# Altium schematic sheet P1.schdoc
size 420 x 297 mm; Symbol: Sheet-Symbol_A4; Company: 嘉立创EDA; Version: V1.0; Page Size: A4; @Project Name: AI开发板; @Page Count: 1; @Update Date: 2025-10-23; @Create Date: 2025-10-11; @Schematic Name: Schematic2; @Page No: 0; @Page Name: P1; Device: Sheet-Symbol_A4; @Board Name: 头戴式; @Create Time: 11:14:55; @Update Time: 22:55:59; Border: 1; Width: 1655; Height: 1170; Region Start: 1; X Region Count: 6; Y Region Count: 4; Blade Width: 10; Title Block Position: 3
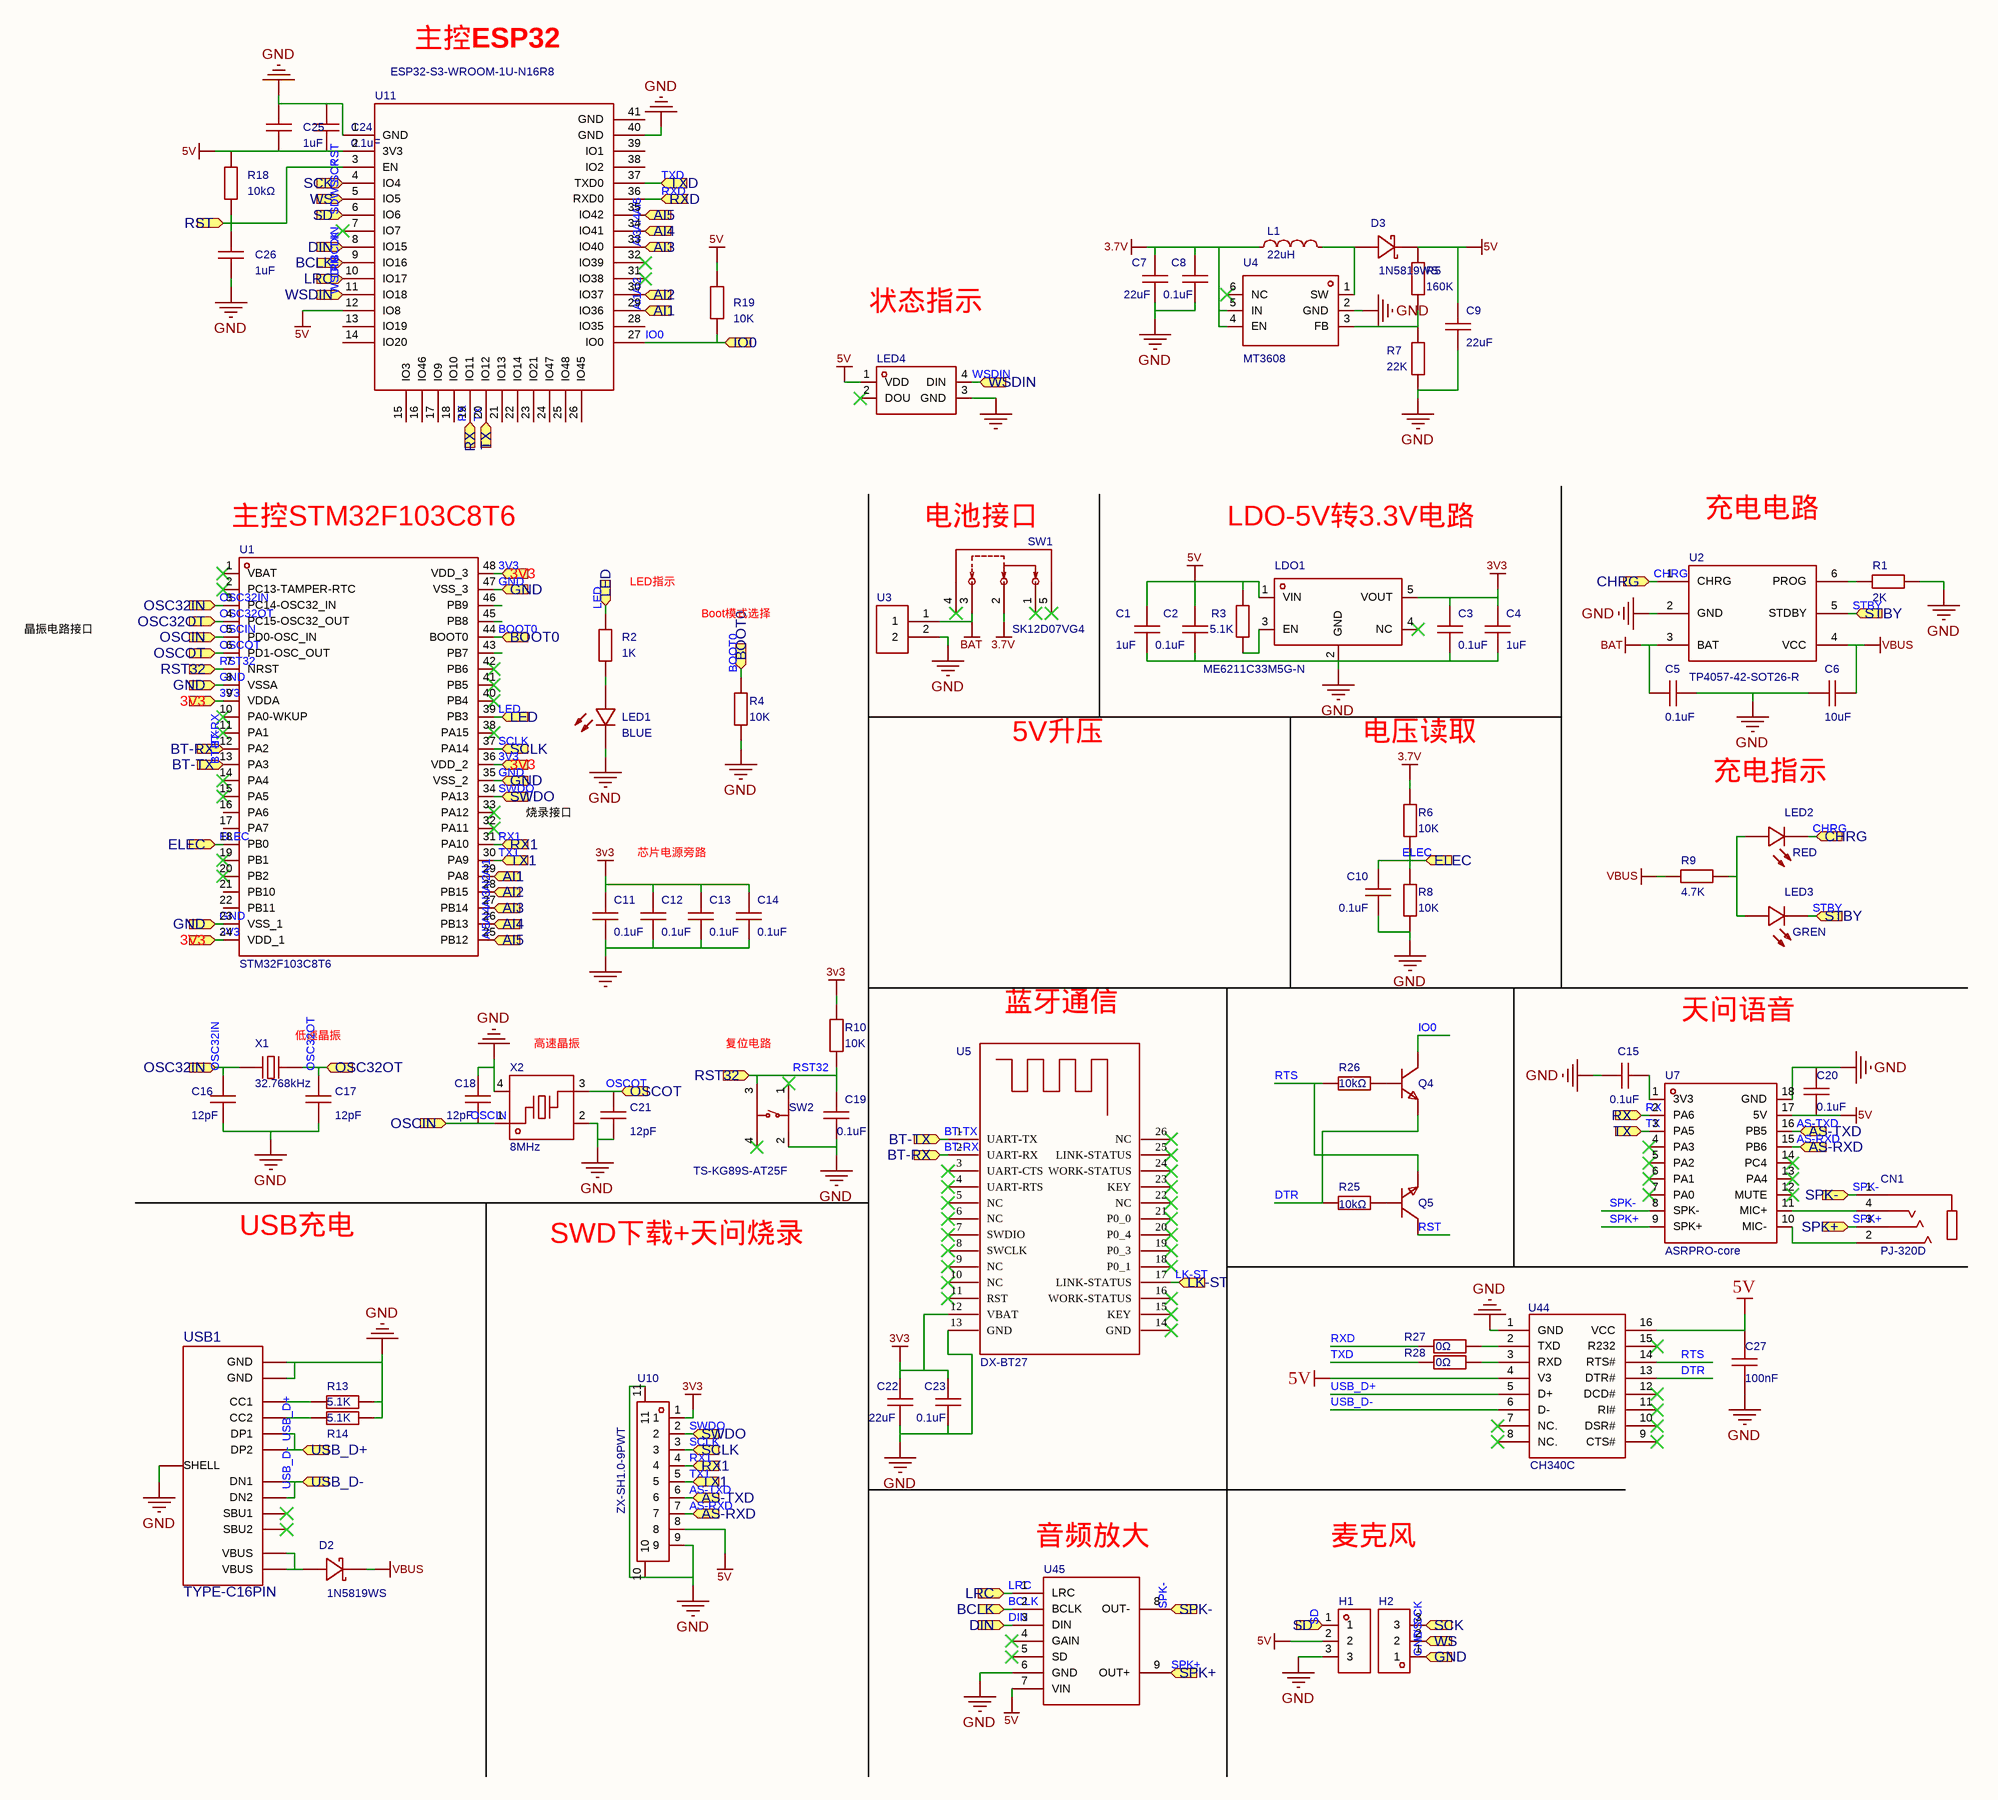
[diagram p0: P1.schdoc]

## Parts
C1  1uF  [C0603]
C2  0.1uF  [C0603]
C3  0.1uF  [C0603]
C4  1uF  [C0603]
C5  0.1uF  [C0603]
C6  10uF  [C0603]
C7  22uF  [C0603]
C8  0.1uF  [C0603]
C9  22uF  [C0603]
C10  0.1uF  [C0603]
C11  0.1uF  [C0603]
C12  0.1uF  [C0603]
C13  0.1uF  [C0603]
C14  0.1uF  [C0603]
C15  0.1uF  [C0603]
C16  12pF  [C0603]
C17  12pF  [C0603]
C18  12pF  [C0603]
C19  0.1uF  [C0603]
C20  0.1uF  [C0603]
C21  12pF  [C0603]
C22  22uF  [C0603]
C23  0.1uF  [C0603]
C24  0.1uF  [C0603]
C25  1uF  [C0603]
C26  value 1uF  [C0603]  (hidden comment: CL10A105KB8NNNC)
C27  value 100nF  [C0603]  (hidden comment: CC0603KRX7R9BB104)
CN1  PJ-320D  [AUDIO-SMD_PJ-320D]
D2  1N5819WS  [SOD-323_L1.6-W1.3-LS2.7-RD]
D3  1N5819WS  [SOD-323_L1.6-W1.3-LS2.7-RD]
H1  PZ254V-11-03P  [HDR-TH_3P-P2.54-V-M]  (value not drawn)
H2  PZ254V-11-03P  [HDR-TH_3P-P2.54-V-M]  (value not drawn)
L1  22uH  [IND-SMD_L7.4-W6.6]
LDO1  ME6211C33M5G-N  [SOT-23-5_L3.0-W1.7-P0.95-LS2.8-BL]
LED1  BLUE  [LED0603-RD_RED]
LED2  RED  [LED0603-RD_RED]
LED3  GREN  [LED0603-RD_RED]
LED4  XL-5050RGBC-WS2812B  [LED-SMD_4P-L5.0-W5.0-BL_XL-5050RGBC]  (value not drawn)
Q4  SS8050_C2150  [SOT-23-3_L2.9-W1.3-P1.90-LS2.4-BR]  (value not drawn)
Q5  SS8050_C2150  [SOT-23-3_L2.9-W1.3-P1.90-LS2.4-BR]  (value not drawn)
R1  2K  [R0603]
R2  1K  [R0603]
R3  5.1K  [R0603]
R4  10K  [R0603]
R5  160K  [R0603]
R6  10K  [R0603]
R7  22K  [R0603]
R8  10K  [R0603]
R9  4.7K  [R0603]
R10  10K  [R0603]
R13  5.1K  [R0603]
R14  5.1K  [R0603]
R18  value 10kΩ  [R0603]  (hidden comment: 0603WAF1002T5E)
R19  10K  [R0603]
R25  10kΩ  [R0603]
R26  10kΩ  [R0603]
R27  value 0Ω  [R0603]  (hidden comment: 0603WAF0000T5E)
R28  value 0Ω  [R0603]  (hidden comment: 0603WAF0000T5E)
SW1  SK12D07VG4  [SW-TH_SK12D07VG4]
SW2  TS-KG89S-AT25F  [SW-SMD_4P-L4.2-W3.3-P2.15-LS5.1]
U1  STM32F103C8T6  [LQFP-48_L7.0-W7.0-P0.50-LS9.0-BL]
U2  TP4057-42-SOT26-R  [SOT-23-6_L2.9-W1.6-P0.95-LS2.8-BL]
U3  (no value)  [1*2-2.54单排针]
U4  MT3608  [SOT-23-6_L2.9-W1.6-P0.95-LS2.8-BL]
U5  DX-BT27  [DX-BT24]
U7  ASRPRO-core  [COMM-SMD_ASRPRO-CORE-V1.1]
U10  ZX-SH1.0-9PWT  [CONN-SMD_9P-P1.00_ZX-SH1.0-9PWT]
U11  ESP32-S3-WROOM-1U-N16R8  [WIRELM-SMD_ESP32-S3-WROOM-1U]
U44  CH340C  [SOP-16_L10.0-W3.9-P1.27-LS6.0-BL]
U45  (no value)  [MAX98357moudle]
USB1  TYPE-C16PIN  [usb-c-smd_type-c16pin-shouhan]
X1  32.768kHz  [OSC-SMD_L3.2-W1.5]
X2  8MHz  [CRYSTAL-SMD_4P-L3.2-W2.5-BL-1]

## Ports
3V3 (in), AI1 (in), AI2 (in), AI3 (in), AI4 (in), AI5 (in), AS-RXD (in), AS-TXD (in), BCLK (in), BOOT0 (in), BT-RX (in), BT-TX (in), CHRG (in), DIN (in), ELEC (in), GND (in), IO0 (in), LED (in), LK-ST (in), LRC (in), OSC32IN (in), OSC32OT (in), OSCIN (in), OSCOT (in), RST32 (in), RST (in), RX1 (in), RX (in), RXD (in), SCK (in), SCLK (in), SD (in), SPK+ (in), SPK- (in), STBY (in), SWDO (in), TX1 (in), TX (in), TXD (in), USB_D+ (in), USB_D- (in), WS (in), WSDIN (in)

## Nets
3.7V: C7.2 C8.2 L1.1 R6.2 SW1.2 U4.4(EN) U4.5(IN)
3V3: C3.2 C4.2 C11.2 C12.2 C13.2 C14.2 C22.2 C23.2 LDO1.5(VOUT) R10.2 U1.9(VDDA) U1.24(VDD_1) U1.36(VDD_2) U1.48(VDD_3) U5.12(VBAT) U10.1 ; port 3V3
5V: C1.2 C2.2 C9.2 C20.1 C24.1 C25.1 C27.1 D3.1(K) H1.2 LDO1.1(VIN) LED4.1(VDD) R3.1 R5.1 R18.2 R19.2 U7.17(5V) U10.8 U11.2(3V3) U11.12(IO8) U44.4(V3) U44.16(VCC) U45.7(VIN)
BAT: C5.2 SW1.3 U2.3(BAT) U3.1
GND: C1.1 C2.1 C3.1 C4.1 C5.1 C6.2 C7.1 C8.1 C9.1 C10.1 C11.1 C12.1 C13.1 C14.1 C15.2 C16.1 C17.1 C18.2 C19.1 C20.2 C21.1 C22.1 C23.1 C24.2 C25.2 C26.1 C27.2 H1.3 H2.1 LDO1.2(GND) LED1.1(K) LED4.3(GND) R1.1 R4.1 R7.2 R8.1 R13.1 R14.1 SW2.2 U1.8(VSSA) U1.23(VSS_1) U1.35(VSS_2) U1.47(VSS_3) U2.2(GND) U3.2 U4.2(GND) U5.13(GND) U7.18(GND) U10.9 U10.10 U10.11 U11.1(GND) U11.40(GND) U44.1(GND) U45.6(GND) USB1.1(SHELL) USB1.2(SHELL) USB1.3(SHELL) USB1.4(SHELL) USB1.A1B12(GND) USB1.B1A12(GND) X2.2(GND) X2.4(GND) ; port GND
VBUS: C6.1 D2.1(K) R9.2 U2.4(VCC)
AI1: U1.29(PA8) U11.29(IO36) ; port AI1
AI2: U1.28(PB15) U11.30(IO37) ; port AI2
AI3: U1.27(PB14) U11.33(IO40) ; port AI3
AI4: U1.26(PB13) U11.34(IO41) ; port AI4
AI5: U1.25(PB12) U11.35(IO42) ; port AI5
AS-RXD: U7.15(PB6) U10.7 ; port AS-RXD
AS-TXD: U7.16(PB5) U10.6 ; port AS-TXD
BCLK: U11.9(IO16) U45.2(BCLK) ; port BCLK
BOOT0: R4.2 U1.44(BOOT0) ; port BOOT0
BT-RX: U1.12(PA2) U5.2(UART-RX) ; port BT-RX
BT-TX: U1.13(PA3) U5.1(UART-TX) ; port BT-TX
CHRG: LED2.1(K) U2.1(CHRG) ; port CHRG
DIN: U11.8(IO15) U45.3(DIN) ; port DIN
DTR: Q4.2(E) R25.2 U44.13(DTR#)
ELEC: C10.2 R6.1 R8.2 U1.18(PB0) ; port ELEC
IO0: Q4.3(C) R19.1 U11.27(IO0) ; port IO0
LED: R2.2 U1.39(PB3) ; port LED
LK-ST: U5.17(LINK-STATUS) ; port LK-ST
LRC: U11.10(IO17) U45.1(LRC) ; port LRC
OSC32IN: C16.2 U1.3(PC14-OSC32_IN) X1.1 ; port OSC32IN
OSC32OT: C17.2 U1.4(PC15-OSC32_OUT) X1.2 ; port OSC32OT
OSCIN: C18.1 U1.5(PD0-OSC_IN) X2.1 ; port OSCIN
OSCOT: C21.2 U1.6(PD1-OSC_OUT) X2.3 ; port OSCOT
RST: C26.2 Q5.3(C) R18.1 U11.3(EN) ; port RST
RST32: C19.2 R10.1 SW2.3 U1.7(NRST) ; port RST32
RTS: Q5.2(E) R26.2 U44.14(RTS#)
RX: U7.2(PA6) U11.19(IO11) ; port RX
RX1: U1.31(PA10) U10.4 ; port RX1
RXD: R27.2 U11.36(RXD0) ; port RXD
SCK: H2.3 U11.4(IO4) ; port SCK
SCLK: U1.37(PA14) U10.3 ; port SCLK
SD: H1.1 U11.6(IO6) ; port SD
SPK+: CN1.3 U7.9(SPK+) U45.9(OUT+) ; port SPK+
SPK-: CN1.1 U7.8(SPK-) U45.8(OUT-) ; port SPK-
STBY: LED3.1(K) U2.5(STDBY) ; port STBY
SWDO: U1.34(PA13) U10.2 ; port SWDO
TX: U7.3(PA5) U11.20(IO12) ; port TX
TX1: U1.30(PA9) U10.5 ; port TX1
TXD: R28.2 U11.37(TXD0) ; port TXD
USB_D+: U44.5(D+) USB1.A6(DP1) USB1.B6(DP2) ; port USB_D+
USB_D-: U44.6(D-) USB1.A7(DN1) USB1.B7(DN2) ; port USB_D-
WS: H2.2 U11.5(IO5) ; port WS
WSDIN: LED4.4(DIN) U11.11(IO18) ; port WSDIN
NetC15_1: C15.1 U7.1(3V3)
NetCN1_2: CN1.2 U7.10(MIC-)
NetCN1_4: CN1.4 U7.11(MIC+)
NetD2_2: D2.2(A) USB1.A4B9(VBUS) USB1.B4A9(VBUS)
NetD3_2: D3.2(A) L1.2 U4.1(SW)
NetLDO1_3: LDO1.3(EN) R3.2
NetLED1_2: LED1.2(A) R2.1
NetLED2_2: LED2.2(A) LED3.2(A) R9.1
NetQ4_1: Q4.1(B) R26.1
NetQ5_1: Q5.1(B) R25.1
NetR1_2: R1.2 U2.6(PROG)
NetR5_2: R5.2 R7.1 U4.3(FB)
NetR13_2: R13.2 USB1.A5(CC1)
NetR14_2: R14.2 USB1.B5(CC2)
NetR27_1: R27.1 U44.2(TXD)
NetR28_1: R28.1 U44.3(RXD)

Not connected (* = marked no-connect by the designer): LDO1 4(NC)*; LED4 2(DOU)*; SW1 1* 4* 5*; SW2 1* 4*; U1 1(VBAT)* 2(PC13-TAMPER-RTC)* 10(PA0-WKUP)* 11(PA1)* 14(PA4)* 15(PA5)* 16(PA6) 17(PA7) 19(PB1)* 20(PB2)* 21(PB10) 22(PB11) 32(PA11)* 33(PA12)* 38(PA15)* 40(PB4)* 41(PB5)* 42(PB6)* 43(PB7) 45(PB8) 46(PB9); U4 6(NC)*; U5 3(UART-CTS)* 4(UART-RTS)* 5(NC)* 6(NC)* 7(SWDIO)* 8(SWCLK)* 9(NC)* 10(NC)* 11(RST)* 14(GND)* 15(KEY)* 16(WORK-STATUS)* 18(P0_1)* 19(P0_3)* 20(P0_4)* 21(P0_0)* 22(NC)* 23(KEY)* 24(WORK-STATUS)* 25(LINK-STATUS)* 26(NC)*; U7 4(PA3)* 5(PA2)* 6(PA1)* 7(PA0)* 12(MUTE)* 13(PA4)* 14(PC4)*; U11 7(IO7)* 13(IO19) 14(IO20) 15(IO3) 16(IO46) 17(IO9) 18(IO10) 21(IO13) 22(IO14) 23(IO21) 24(IO47) 25(IO48) 26(IO45) 28(IO35) 31(IO38)* 32(IO39)* 38(IO2) 39(IO1) 41(GND); U44 7(NC.)* 8(NC.)* 9(CTS#)* 10(DSR#)* 11(RI#)* 12(DCD#)* 15(R232)*; U45 4(GAIN)* 5(SD)*; USB1 A8(SBU1)* B8(SBU2)*

## Notes on the sheet
- 主控ESP32
- 状态指示
- (near U1) 主控STM32F103C8T6
- (near SW1) 电池接口
- LDO-5V转3.3V电路
- (near U2) 充电电路
- 晶振电路接口
- (near R2) LED指示
- Boot模式选择
- 5V升压
- 电压读取
- 充电指示
- (near U1) 烧录接口
- 芯片电源旁路
- 蓝牙通信
- 天问语音
- (near X1) 低速晶振
- (near X2) 高速晶振
- (near SW2) 复位电路
- USB充电
- SWD下载+天问烧录
- (near U45) 音频放大
- 麦克风
- 更新日期
- 2025-10-23
- 原理图
- 图页
- Schematic2
- P1
- 创建日期
- 物料编码
- 2025-10-11
- 审阅
- 绘制
- AI开发板
- 版本
- V1.0
- 尺寸
- A4
- 页
- 0
- 嘉立创EDA
- 共
- 1

## Library data of the parts
C1-C26 = CL10A105KB8NNNC: 容值:1uF;精度:±10%;额定电压:50V;材质(温度系数):X5R;; Manufacturer: SAMSUNG(三星); AddInBom: yes; ModelId: ac125912035d415993ca9572d50418b1; ModelName: C0603_L1.6-W0.8-H0.8; ModelTransform: 62.992,31.496,0,0,0,0,0,0,0; Tolerance: ±10%; Voltage Rated: 50V; Temperature Coefficient: X5R; Device: CL10A105KB8NNNC; Symbol: CL10A105KB8NNNC; LCSC Part Name: 1uF±10%50V; ManufacturerPart: CL10A105KB8NNNC; Supplier Footprint: 0603; JLCPCB Part Class: BasicPart; Datasheet: https://atta.szlcsc.com/upload/public/pdf/source/20160103/1457707679084.pdf; Supplier: LCSC; ConvertToPcb: yes; FootprintName: C0603
  C1 C4: Value: 1uF
  C2 C3 C5 C8 C10-C15 C19 C20 C23 C24: Value: 0.1uF
  C6: Value: 10uF
  C7 C9 C22: Value: 22uF
  C16-C18 C21: Value: 12pF
  C25: SupplierPart: C15849; Value: 1uF
  C26: SupplierPart: C15849
C27 = CC0603KRX7R9BB104: 容值:100nF;精度:±10%;额定电压:50V;材质(温度系数):X7R;; Manufacturer: YAGEO(国巨); Symbol: C1210X7R475K630NT; AddInBom: yes; ModelId: ac125912035d415993ca9572d50418b1; ModelName: C0603_L1.6-W0.8-H0.8; ModelTransform: 62.992,31.496,0,0,0,0,0,0,0; Tolerance: ±10%; Voltage Rated: 50V; Temperature Coefficient: X7R; Device: CC0603KRX7R9BB104; LCSC Part Name: 100nF ±10% 50V; SupplierPart: C14663; ManufacturerPart: CC0603KRX7R9BB104; Supplier Footprint: 0603; JLCPCB Part Class: Basic Part; Datasheet: https://atta.szlcsc.com/upload/public/pdf/source/20170116/1484561234239.pdf; Supplier: LCSC; ConvertToPcb: yes; FootprintName: C0603
CN1 = PJ-320D_C431535: 连接器类型:3.5mm耳机座;额定电流:300mA;额定电压:50V;工作温度范围:-16℃~+65℃;; Manufacturer: SHOU HAN(首韩); AddInBom: yes; ModelId: bd09d36f1dc146ba8e7977b9497f1865; ModelName: AUDIO-SMD_L12.1-W6.1-H5.0-4P; ModelTransform: 314.96,555.117,0,0,0,0,0.001,87.24,-27.559; Current Rating (Max): 300mA; Voltage Rating (Max): 50V; Symbol: PJ-320D; Device: PJ-320D_C431535; LCSC Part Name: 3.5mm耳机座; SupplierPart: C431535; ManufacturerPart: PJ-320D; Supplier Footprint: SMD; Datasheet: https://atta.szlcsc.com/upload/public/pdf/source/20190925/C431535_8B274506621F6117FB020BF07A197848.pdf; Supplier: LCSC; ConvertToPcb: yes; FootprintName: AUDIO-SMD_PJ-320D; Connector Type: 3.5mm耳机座; Operating Temperature Range: -16℃~+65℃
D2 D3 = 1N5819WS_C727116: Manufacturer: TWGMC(台湾迪嘉); AddInBom: yes; ModelId: 39bca86493a8419684ee2090e9340edf; ModelTransform: 104.3305,51.181,0,0,0,0,0,0,0; Device: 1N5819WS_C727116; Symbol: 1N5819WS_C727116; LCSC Part Name: 1N5819WS; SupplierPart: C727116; ManufacturerPart: 1N5819WS; Supplier Footprint: SOD-323; JLCPCB Part Class: Extended Part; Datasheet: https://atta.szlcsc.com/upload/public/pdf/source/20200828/C727114_C14023D00363B04EEE1ED2B617BD8BD7.pdf; Supplier: LCSC; ConvertToPcb: yes; FootprintName: SOD-323_L1.6-W1.3-LS2.7-RD; ModelName: SOD-323_L1.6-W1.3-LS2.7-RD
H1 H2 = PZ254V-11-03P: 插针结构:1x3P;间距:2.54mm;行距:-;圆针/方针:方针;安装方式:直插;排数:单排;总PIN位数:3P;额定电流:3A;额定电压:250V;配合针长度:6mm;塑高:2.5mm;端接针长度:3mm;工作温度:-40℃~+105℃;颜色:黑色;; Manufacturer: XFCN(兴飞); Symbol: PZ254V-11-03P_C2937625; AddInBom: yes; ModelId: bb473b6d38ff42a99216a4fcdbdcc4cb; ModelName: HDR-TH_3P-P2.54-M-LI-1X3P; ModelTransform: 299.9994,100,0,0,0,0,0,0,-118.11; Pin Structure: 1x3P; Pitch: 2.54mm; Circluar Pins/Square Pins: 方针; Current Rating: 3A; Voltage Rating (Max): 250V; Device: PZ254V-11-03P; LCSC Part Name: 1x3P 间距:2.54mm 方针 直插; SupplierPart: C2937625; ManufacturerPart: PZ254V-11-03P; Supplier Footprint: 插件,P=2.54mm; JLCPCB Part Class: 扩展库; Datasheet: https://atta.szlcsc.com/upload/public/pdf/source/20200309/C492402_8335C3D49C4E4C618838D59BB1D024C1.pdf; Supplier: LCSC; ConvertToPcb: yes; FootprintName: HDR-TH_3P-P2.54-V-M; Row Spacing: -; Mounting Type: 直插; Number of Rows: 单排; Number of Pins: 3P; Length of Mating Pin: 6mm; Insulation Height: 2.5mm; Length of End Connection Pin: 3mm; Operating Temperature: -40℃~+105℃; Color: 黑色
L1 = MS0630-220M: 电感值:22uH;精度:±20%;额定电流:1.5A;; Manufacturer: COILMX(迈翔科技); AddInBom: yes; ModelId: 6ebe9088926641d898f5999c0d913d3a; ModelName: IND-SMD_L7.4-W6.6-H1.8; ModelTransform: 291.338,259.842,0,0,0,0,0,0,0; Tolerance: ±20%; Rated Current: 1.5A; DC Resistance (DCR): 165mΩ; Device: MS0630-220M; Symbol: MS0630-220M; LCSC Part Name: 22uH ±20%; SupplierPart: C380183; ManufacturerPart: MS0630-220M; Supplier Footprint: SMD; JLCPCB Part Class: 扩展库; Datasheet: https://atta.szlcsc.com/upload/public/pdf/source/20190429/C380183_D15BB80F49C96307481ABD5C565771EF.pdf; Supplier: LCSC; ConvertToPcb: yes; FootprintName: IND-SMD_L7.4-W6.6; Value: 22uH
LDO1 = ME6211C33M5G-N: 输出类型:固定;输出极性:正;最大输入电压:6V;输出电压:3.3V;输出电流:500mA;电源纹波抑制比(PSRR):70dB;; Manufacturer: MICRONE(南京微盟); AddInBom: yes; Output Type: 固定; Output Polarity: 正; Number of Outputs: 1; Maximum Input Voltage: 6V; Output Voltage: 3.3V; Dropout Voltage: 260mV@(200mA); Output Current: 500mA; Power Supply Rejection Ratio (PSRR): 70dB; ModelId: 0a2a1b8f50944f73965918ad6e5fe167; ModelName: SOT-23-5_L2.9-W1.6-H1.1-LS2.8-P0.95; ModelTransform: 118.60433,114.173,0,90,0,0,0.0005,0.0005,0; Device: ME6211C33M5G-N; LCSC Part Name: ME6211C33M5G-N; SupplierPart: C82942; ManufacturerPart: ME6211C33M5G-N; Supplier Footprint: SOT-23-5; Datasheet: https://atta.szlcsc.com/upload/public/pdf/source/20170918/C82942_1505727073070976520.pdf; Supplier: LCSC; ConvertToPcb: yes; SymbolName: ME6211C33M5G-N; FootprintName: SOT-23-5_L3.0-W1.7-P0.95-LS2.8-BL
LED1-LED3 = NCD0603R1_C84263: 发光颜色:红灯;; Manufacturer: 国星光电; Symbol: FC-DA1608HRK-620D; AddInBom: yes; ModelId: 74041d3a270d435c8600a9ab9b7641c0; ModelTransform: 63.7794,31.496,0,0,0,0,0,0,0; Emitted Color: 红灯; Device: NCD0603R1_C84263; LCSC Part Name: 红灯; SupplierPart: C84263; Supplier Footprint: 0603; Datasheet: https://atta.szlcsc.com/upload/public/pdf/source/20200820/C84263_DABC6A75E58F576973B407FDBA283D60.pdf; Supplier: LCSC; ConvertToPcb: yes; FootprintName: LED0603-RD_RED; ModelName: LED0603-RD_RED
  LED1: Manufacturer Part: BLUE
  LED2: Manufacturer Part: RED
  LED3: Manufacturer Part: GREN
LED4 = XL-5050RGBC-WS2812B: 5050七彩幻彩透明贴片LED灯珠 5050 幻彩透明四脚 ws2812B 内置驱动IC; Manufacturer: XINGLIGHT(成兴光); AddInBom: yes; ModelId: 5168ba52986f49888734e6544170656a; ModelTransform: 212.598,196.85,0,270,0,0,0,0,0; Symbol: XL-5050RGBC-WS2812B; Device: XL-5050RGBC-WS2812B; LCSC Part Name: XL-5050RGBC-WS2812B; SupplierPart: C2843785; ManufacturerPart: XL-5050RGBC-WS2812B; Supplier Footprint: SMD5050; JLCPCB Part Class: 扩展库; Datasheet: https://atta.szlcsc.com/upload/public/pdf/source/20240412/E1004CAA80592E31D08BFE019083806F.pdf; Supplier: LCSC; ConvertToPcb: yes; FootprintName: LED-SMD_4P-L5.0-W5.0-BL_XL-5050RGBC; ModelName: LED-SMD_4P-L5.0-W5.0-BL_XL-5050RGBC
Q4 Q5 = SS8050_C2150: 晶体管类型:NPN;集电极电流(Ic):1.5A;集射极击穿电压(Vceo):25V;功率(Pd):300mW;直流电流增益(hFE@Ic,Vce):200@100mA,1V;; Manufacturer: CJ(江苏长电/长晶); ManufacturerPart: SS8050; AddInBom: yes; ModelId: c62791f0466c4ae2a892c056b845b0ca; ModelName: SOT-23-3P_L2.9-W1.3-H1.0-LS2.4-P0.95; ModelTransform: 98.425,114.173,0,180,0,0,0.0005,-0.0005,0; Transistor Type: NPN; Collector Current (Ic): 1.5A; Collector-Emitter Breakdown Voltage (Vceo): 25V; Power Dissipation (Pd): 300mW; Transition Frequency (fT): 100MHz; Collector Cut-Off Current (Icbo): 100nA; Collector-Emitter Saturation Voltage (VCE(sat)@Ic,Ib): 500mV@800mA,80mA; Symbol: SS8050_C2150; Device: SS8050_C2150; LCSC Part Name: SS8050(RANGE:200-350) hfe=200~350; SupplierPart: C2150; Supplier Footprint: SOT-23; JLCPCB Part Class: 基础库; Datasheet: https://atta.szlcsc.com/upload/public/pdf/source/20230322/AEE86F4B043774EFF80CAEA14A37D9E9.pdf; Supplier: LCSC; ConvertToPcb: yes; FootprintName: SOT-23-3_L2.9-W1.3-P1.90-LS2.4-BR; DC Current Gain (hFE@Ic,Vce): 200@100mA,1V; Operating Temperature: -
R1-R10 R13 R14 R18 R19 = 0603WAF1002T5E: 电阻类型:厚膜电阻;阻值:10kΩ;精度:±1%;功率:100mW;; Manufacturer: UNI-ROYAL(厚声); AddInBom: yes; ModelId: fc143cca1e79419f9cd78b61e9279f08; ModelTransform: 31.8897,63.7794,0,90,0,0,0,0,0; Tolerance: ±1%; Power(Watts): 100mW; Temperature Coefficient: ±100ppm/℃; Overload Voltage (Max): 75V; Device: 0603WAF1002T5E; Symbol: 0603WAF1002T5E; LCSC Part Name: 厚膜电阻10kΩ±1%100mW; ManufacturerPart: 0603WAF1002T5E; Supplier Footprint: 0603; JLCPCB Part Class: BasicPart; Datasheet: https://atta.szlcsc.com/upload/public/pdf/source/20200306/C422600_1E6D84923E4A46A82E41ADD87F860B5C.pdf; Supplier: LCSC; ConvertToPcb: yes; FootprintName: R0603; ModelName: R0603; Type: 厚膜电阻; Operating Temperature Range: -55℃~+155℃
  R1: Value: 2K
  R2: Value: 1K
  R3 R13 R14: Value: 5.1K
  R4 R6 R8 R10 R19: Value: 10K
  R5: Value: 160K
  R7: Value: 22K
  R9: Value: 4.7K
  R18: SupplierPart: C25804
R25 R26 = 0603WAF1002T5E: 电阻类型:厚膜电阻;阻值:10kΩ;精度:±1%;功率:100mW;最大工作电压:75V;温度系数:±100ppm/℃;; Manufacturer: UNI-ROYAL(厚声); Symbol: 电阻_1; AddInBom: yes; ModelId: fc143cca1e79419f9cd78b61e9279f08; ModelTransform: 31.8897,63.7794,0,90,0,0,0,0,0; Tolerance: ±1%; Power(Watts): 100mW; Overload Voltage (Max): 75V; Value: 10kΩ; Device: 0603WAF1002T5E; LCSC Part Name: 厚膜电阻10kΩ±1%100mW; SupplierPart: C25804; ManufacturerPart: 0603WAF1002T5E; Supplier Footprint: 0603; JLCPCB Part Class: BasicPart; Datasheet: https://atta.szlcsc.com/upload/public/pdf/source/20200306/C422600_1E6D84923E4A46A82E41ADD87F860B5C.pdf; Supplier: LCSC; ConvertToPcb: yes; FootprintName: R0603; ModelName: R0603; Type: 厚膜电阻; Temperature Coefficient: ±100ppm/℃; Operating Temperature Range: -55℃~+155℃
R27 R28 = 0603WAF0000T5E: 电阻类型:厚膜电阻;阻值:0Ω;精度:±1%;功率:100mW;; Manufacturer: UNI-ROYAL(厚声); AddInBom: yes; ModelId: fc143cca1e79419f9cd78b61e9279f08; ModelTransform: 31.8897,63.7794,0,90,0,0,0,0,0; Tolerance: ±1%; Power(Watts): 100mW; Overload Voltage (Max): 75V; Device: 0603WAF0000T5E; Symbol: 0603WAF0000T5E; LCSC Part Name: 0Ω ±1% 100mW; SupplierPart: C21189; ManufacturerPart: 0603WAF0000T5E; Supplier Footprint: 0603; JLCPCB Part Class: Basic Part; Datasheet: https://atta.szlcsc.com/upload/public/pdf/source/20200306/C422600_1E6D84923E4A46A82E41ADD87F860B5C.pdf; Supplier: LCSC; ConvertToPcb: yes; FootprintName: R0603; ModelName: R0603; Type: 厚膜电阻; Operating Temperature Range: -55℃~+155℃
SW1 = SK12D07VG4: 电路结构:单刀双掷;安装方式:-;额定电流(DC):500mA;额定电压(DC):50V;额定电流(AC):-;额定电压(AC):-;机械寿命:5千次;; Manufacturer: SHOU HAN(首韩); AddInBom: yes; ModelId: 773c51563d484e3a80810244c5d56a16; ModelName: SW-TH_L8.7-W4.4-H4.0-P2.0; ModelTransform: 338.582,279.527,0,0,0,0,0,-51.181,-125.984; Circuit: 单刀双掷; Actuator Style: 矩形柱状; Pin Style: PC引脚; Switch Height: 8.8mm; Current Rating (DC): 500mA; Voltage Rating (DC): 50V; Mechanical Life: 5千次; Symbol: SK12D07VG4; Device: SK12D07VG4; LCSC Part Name: 3脚2档位 卧插 滑动开关; SupplierPart: C393937; ManufacturerPart: SK12D07VG4; Supplier Footprint: 插件; Datasheet: https://atta.szlcsc.com/upload/public/pdf/source/20190521/C393937_939FE26E571CC67D2D532E953108A1B0.pdf; Supplier: LCSC; ConvertToPcb: yes; FootprintName: SW-TH_SK12D07VG4; Mounting Style: -; Current Rating (AC): -; Voltage Rating (AC): -; Operating Temperature: -
SW2 = TS-KG89S-AT25F: 触点电流:50mA;额定电压(DC):12V;绝缘电阻:100MΩ;电路结构:单刀单掷;安装方式:立贴;作用力:250gf@±50gf;机械寿命:10万次;带支架:否;; Manufacturer: HANBO(汉博); AddInBom: yes; ModelId: 101da67941e24d4e9615179a94fc6132; ModelName: SW-SMD_4P-L4.2-W3.3-H2.5-P2.15-LS5.1; ModelTransform: 204.724,127.9525,0,0,0,0,0,0,0; Contact Current: 50mA; Voltage Rating (DC): 12V; Insulation Resistance: 100MΩ; Circuit: 单刀单掷; Actuator Style: 椭圆形按钮; Actuator/Cap Color: 白色; Mechanical Life: 10万次; Pin Style: SMD接片; Switch Length: 4.2mm; Switch Width: 3.25mm; Switch Height: 2.5mm; Strike Gundam: 否; Device: TS-KG89S-AT25F; Symbol: TS-KG89S-AT25F; LCSC Part Name: 4.2*3.25*2.5mm 立贴 轻触开关; SupplierPart: C2874599; ManufacturerPart: TS-KG89S-AT25F; Supplier Footprint: SMD; Datasheet: https://atta.szlcsc.com/upload/public/pdf/source/20221110/0D75E68DCC1CEC2670E8A2B9A9134A65.pdf; Supplier: LCSC; ConvertToPcb: yes; FootprintName: SW-SMD_4P-L4.2-W3.3-P2.15-LS5.1; Mounting Style: 立贴; Operating Force: 250gf@±50gf
U1 = STM32F103C8T6: CPU内核:ARM-M3;程序存储容量:64KB;RAM总容量:20KB;GPIO端口数量:37;工作电压范围:2V~3.6V;CPU最大主频:72MHz;程序存储器类型:FLASH;; Manufacturer: ST(意法半导体); AddInBom: yes; ModelId: 093be70396ff421eb2cdb946d5311efc; ModelName: LQFP-48_L7.0-W7.0-H1.4-LS9.0-P0.50; ModelTransform: 354.331,354.331,0,0,0,0,0,0,0; CPU Core: ARM-M3; Program Storage Size: 64KB; RAM Size: 20KB; GPIO Ports Number: 37; CPU Maximum Speed: 72MHz; Program Memory Type: FLASH; ADC (Bit): 12bit; Universal Serial Bus: 有; Peripheral/Function: 看门狗；DMA；看门狗；温度传感器; Symbol: STM32F103C8T6; Device: STM32F103C8T6; LCSC Part Name: STM32F103C8T6; SupplierPart: C8734; ManufacturerPart: STM32F103C8T6; Supplier Footprint: LQFP-48(7x7); Datasheet: https://atta.szlcsc.com/upload/public/pdf/source/20220812/8363ACEC51AD55ECEB84799464F7CB85.pdf; Supplier: LCSC; ConvertToPcb: yes; FootprintName: LQFP-48_L7.0-W7.0-P0.50-LS9.0-BL; Operating Voltage Range: 2V~3.6V; Operating Temperature Range: -40℃~+85℃; DAC (Bit): -; PWM (Bit): -; Internal Comparator: -; communication protocol: -; Watchdog: 有; Real-Time Clock: -; Infrared Data Association: 有; Low-Voltage Detect: 有; CCP Capture/Compare: -; Secure Digital Input and Output: -; Direct Memory Access: 有; Internal Oscillator: 有
U2 = TP4057-42-SOT26-R: Manufacturer: TOPPOWER(南京拓微); Symbol: TP4057; AddInBom: yes; ModelId: 18da8f6c14a34920b3e136b5c401a119; ModelName: SOT-23-6_L2.9-W1.6-H1.5-LS2.8-P0.95; ModelTransform: 110.236,113.364,0,90,0,0,0.0005,0.0005,0; Device: TP4057-42-SOT26-R; LCSC Part Name: TP4057 1%; SupplierPart: C12044; ManufacturerPart: TP4057-42-SOT26-R; Supplier Footprint: SOT-23-6; JLCPCB Part Class: Basic Part; Datasheet: https://atta.szlcsc.com/upload/public/pdf/source/20140228/1457706997013.pdf; Supplier: LCSC; ConvertToPcb: yes; FootprintName: SOT-23-6_L2.9-W1.6-P0.95-LS2.8-BL
U3 = 2.54-2P排针: AddInBom: yes; Symbol: 2.54-2P排针; Device: 2.54-2P排针; ConvertToPcb: yes; FootprintName: 1*2-2.54单排针
U4 = MT3608: 功能类型:升压型;输入电压:2V~24V;输出电压:28V;输出电流(最大值):-;; Manufacturer: 西安航天民芯; AddInBom: yes; ModelId: 18da8f6c14a34920b3e136b5c401a119; ModelName: SOT-23-6_L2.9-W1.6-H1.5-LS2.8-P0.95; ModelTransform: 110.236,113.364,0,90,0,0,0.0005,0.0005,0; Function: 升压型; Number of Outputs: 1; Topology: 升压式; Input Voltage: 2V~24V; Output Voltage: 28V; Switching Frequency: 1.2MHz; Device: MT3608; Symbol: MT3608; LCSC Part Name: 升压型 输入2V~24V 输出28V; SupplierPart: C84817; ManufacturerPart: MT3608; Supplier Footprint: SOT-23-6; Datasheet: https://atta.szlcsc.com/upload/public/pdf/source/20161110/1478743351706.pdf; Supplier: LCSC; ConvertToPcb: yes; FootprintName: SOT-23-6_L2.9-W1.6-P0.95-LS2.8-BL; Synchronous Rectification: -; Output Current (Max): -
U5 = DX-BT24: AddInBom: yes; _: 3; Device: DX-BT24; Symbol: DX-BT24; ConvertToPcb: yes; PCB DECAL: DX-BT24; FootprintName: DX-BT24
U7 = ASRPRO-core_C9900107962: AddInBom: yes; ModelId: 82c6c2c4b6df4cbbb6ec1b70d6ce4b07; ModelTransform: 688.975,885.825,0,0,0,0,0,0,0; Symbol: ASRPRO-CORE_C9900107962; Device: ASRPRO-core_C9900107962; LCSC Part Name: ASRPRO-core; SupplierPart: C9900107962; ManufacturerPart: ASRPRO-core; Supplier Footprint: SMD-18; JLCPCB Part Class: Extended Part; Supplier: LCSC; ConvertToPcb: yes; FootprintName: COMM-SMD_ASRPRO-CORE-V1.1; ModelName: COMM-SMD_ASRPRO-CORE-V1.1
U10 = ZX-SH1.0-9PWT: 插针结构:1x9P;间距:1mm;安装方式:卧贴;参考系列:SH;总PIN数:9P;排数:1;每排PIN数:9;行距:-;额定电流:1A;触头材质:黄铜;触头镀层:锡;工作温度范围:-25℃~+85℃;; Manufacturer: Megastar(兆星); AddInBom: yes; ModelId: 8f13ebd4b30540a4b4eef921d3b8a2e9; ModelTransform: 447.243,198.8185,0,0,0,0,0.196,-6.062,0; Pins Structure: 1x9P; Pitch: 1mm; Reference Series: SH; Number of PINs Per Row: 9; Current Rating (Max): 1A; Symbol: ZX-SH1.0-9PWT; Device: ZX-SH1.0-9PWT; Supplier: LCSC; Supplier Part: C19272376; Manufacturer Part: ZX-SH1.0-9PWT; LCSC Part Name: 1x9P 间距:1mm 卧贴 系列:SH; Supplier Footprint: SMD,P=1mm,卧贴; Datasheet: https://atta.szlcsc.com/upload/public/pdf/source/20231201/E64981488DAD27D280FAE03D9E5CE5FD.pdf; ConvertToPcb: yes; FootprintName: CONN-SMD_9P-P1.00_ZX-SH1.0-9PWT; ModelName: CONN-SMD_9P-P1.00_ZX-SH1.0-9PWT; Mounting Style: 卧贴; Number of Pins: 9P; Number of Rows: 1; Row Spacing: -; Contact Material: 黄铜; Contact Plating: 锡; Operating Temperature Range: -25℃~+85℃
U11 = ESP32-S3-WROOM-1U-N16R8: Manufacturer: ESPRESSIF(乐鑫); AddInBom: yes; ModelId: 36199533deec4e26b7f6f73abf45ee22; ModelTransform: 709.4474,756.2977,0,0,0,0,0,19.685,0; Symbol: ESP32-S3-WROOM-1U-N16R8; Device: ESP32-S3-WROOM-1U-N16R8; LCSC Part Name: ESP32-S3-WROOM-1U-N16R8; SupplierPart: C3013946; ManufacturerPart: ESP32-S3-WROOM-1U-N16R8; Supplier Footprint: SMD,18x19.2mm; JLCPCB Part Class: 扩展库; Datasheet: https://atta.szlcsc.com/upload/public/pdf/source/20240130/9D71F4DF55874C504AB629FEEE3F038E.pdf; Supplier: LCSC; ConvertToPcb: yes; FootprintName: WIRELM-SMD_ESP32-S3-WROOM-1U; ModelName: WIRELM-SMD_ESP32-S3-WROOM-1U
U44 = CH340C: 类型:Transceiver;协议类别:USB 2.0;驱动器/接收器数:-;数据速率:2Mbps;; Manufacturer: WCH(南京沁恒); AddInBom: yes; ModelId: 3361a6792abf4a8f8fbca4f1924a67ee; ModelName: SOP-16_L9.9-W3.9-H1.5-LS6.0-P1.27; ModelTransform: 240.39054,393.7,0,90,0,0,0,0,0; Protocol: USB 2.0; Data Rate: 2Mbps; Supply Voltage: 3.3V, 5V; Device: CH340C; Symbol: CH340C; LCSC Part Name: CH340C; SupplierPart: C84681; ManufacturerPart: CH340C; Supplier Footprint: SOP-16_150mil; JLCPCB Part Class: Extended Part; Datasheet: https://atta.szlcsc.com/upload/public/pdf/source/20200819/C84681_ADBED554CE321879DBD6B1D06488689C.pdf; Supplier: LCSC; ConvertToPcb: yes; FootprintName: SOP-16_L10.0-W3.9-P1.27-LS6.0-BL; Type: Transceiver; Number of Drivers/Receivers: -
U45 = MAX98357模块: AddInBom: yes; Device: MAX98357模块; ConvertToPcb: yes; SymbolName: MAX98357模块; FootprintName: MAX98357moudle
USB1 = TYPE-C16PIN: Manufacturer: SHOU HAN; Origin Footprint: USB-C-SMD_TYPE-C16PIN; Convert to PCB: yes; Device: TYPE-C16PIN; Symbol: TYPE-C16PIN; Add into BOM: yes; Supplier: LCSC; SupplierPart: C393939; ManufacturerPart: TYPE-C16PIN
X1 = X321532768KGD2SI: 晶振类型:贴片晶振;频率:32.768kHz;常温频差:±20ppm;外接负载电容:12.5pF;频率稳定度(全温):-;; Manufacturer: YXC(扬兴晶振); AddInBom: yes; ModelId: 2dd241c0893b4675b8def6f6998a8251; ModelName: OSC-SMD_L3.2-W1.5-H0.8; ModelTransform: 125.984,59.055,0,0,0,0,0,-0.0005,0; Crystal Type: 贴片晶振; Normal temperature Frequency Tolerance: ±20ppm; External load capacitor: 12.5pF; Symbol: X321532768KGD2SI; Device: X321532768KGD2SI; LCSC Part Name: 32.768kHz ±20ppm 12.5pF; SupplierPart: C620155; ManufacturerPart: X321532768KGD2SI; Supplier Footprint: SMD3215-2P; Datasheet: https://atta.szlcsc.com/upload/public/pdf/source/20240329/3A7650FD985DD0DE85694D3785AB4916.pdf; Supplier: LCSC; ConvertToPcb: yes; FootprintName: OSC-SMD_L3.2-W1.5; Value: 32.768kHz; Frequency Stability(Full temperature range): -; Operating Temperature: -40℃~+85℃
X2 = XL2EL89COI-111YLC-8M: 晶振类型:贴片晶振;频率:8MHz;常温频差:±10ppm;外接负载电容:12pF;频率稳定度(全温):±20ppm;; Manufacturer: YXC(扬兴晶振); AddInBom: yes; ModelId: 4495b492a02c4f389e505ec8ae3aaf1b; ModelTransform: 125.984,98.425,0,0,0,0,0,0,0; Crystal Type: 贴片晶振; Normal temperature Frequency Tolerance: ±10ppm; External load capacitor: 12pF; Frequency Stability(Full temperature range): ±20ppm; Equivalent Series Resistance (ESR): 150Ω; Symbol: XL2EL89COI-111YLC-8M; Device: XL2EL89COI-111YLC-8M; LCSC Part Name: 8MHz ±10ppm 12pF; SupplierPart: C2973805; ManufacturerPart: XL2EL89COI-111YLC-8M; Supplier Footprint: SMD3225-4P; Datasheet: https://atta.szlcsc.com/upload/public/pdf/source/20240329/19D5F850207469550BEB00D7DFEDBC7A.pdf; Supplier: LCSC; ConvertToPcb: yes; FootprintName: CRYSTAL-SMD_4P-L3.2-W2.5-BL-1; ModelName: CRYSTAL-SMD_4P-L3.2-W2.5-BL-1; Value: 8MHz; Operating Temperature: -40℃~+85℃